# EAGLE design LM3914 (EAGLE 6.6.0)
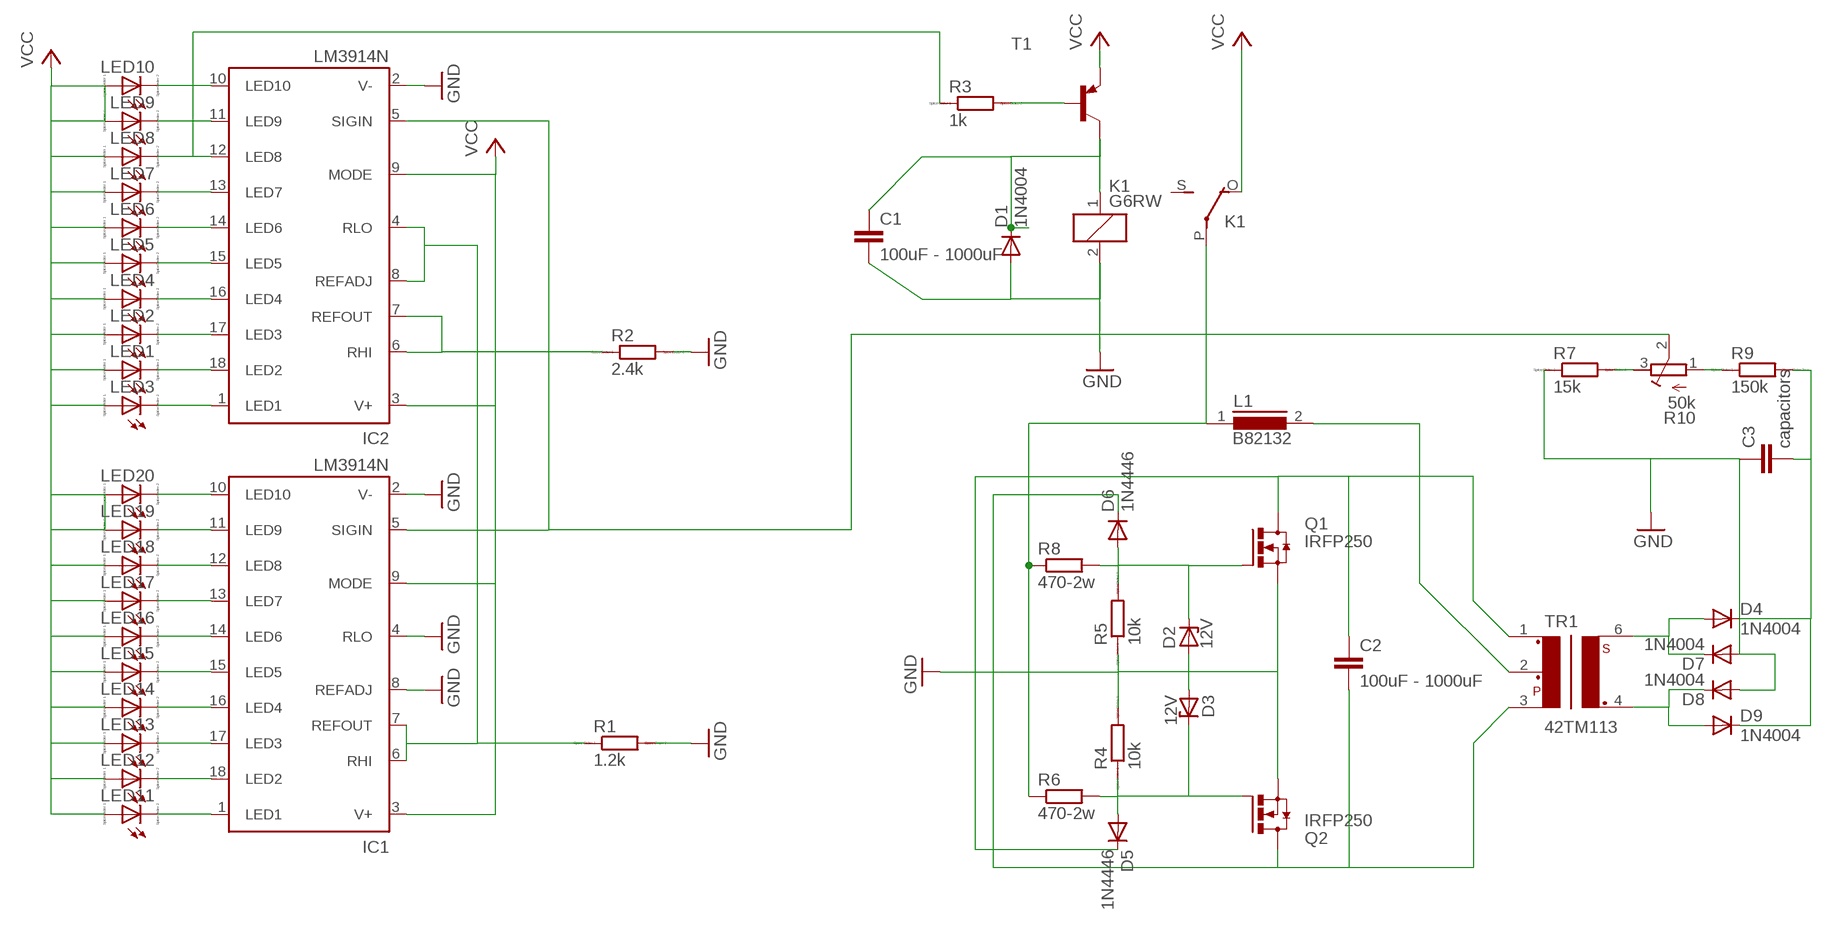
[diagram p0: schematic, sheet 1]

## Parts
C1  100uF - 1000uF  C2,5-3  [C2.5-3]
C2  100uF - 1000uF  C2,5-3  [C2.5-3]
C3  capacitors  C37/20  [C37.5B20]
D1  1N4004  [DO41-10]
D2  12V  ZENER-DIODEC1702-15  [C1702-15]
D3  12V  ZENER-DIODEC1702-15  [C1702-15]
D4  1N4004  [DO41-10]
D5  1N4446  [DO35-10]
D6  1N4446  [DO35-10]
D7  1N4004  [DO41-10]
D8  1N4004  [DO41-10]
D9  1N4004  [DO41-10]
IC1  LM3914N  [DIL18]
IC2  LM3914N  [DIL18]
K1  G6RW  [G6RW]
L1  B82132  [SUKW2-22]
LED1  LED_ELD260  [LED_LD260]
LED2  LED_ELD260  [LED_LD260]
LED3  LED_ELD260  [LED_LD260]
LED4  LED_ELD260  [LED_LD260]
LED5  LED_ELD260  [LED_LD260]
LED6  LED_ELD260  [LED_LD260]
LED7  LED_ELD260  [LED_LD260]
LED8  LED_ELD260  [LED_LD260]
LED9  LED_ELD260  [LED_LD260]
LED10  LED_ELD260  [LED_LD260]
LED11  LED_ELD260  [LED_LD260]
LED12  LED_ELD260  [LED_LD260]
LED13  LED_ELD260  [LED_LD260]
LED14  LED_ELD260  [LED_LD260]
LED15  LED_ELD260  [LED_LD260]
LED16  LED_ELD260  [LED_LD260]
LED17  LED_ELD260  [LED_LD260]
LED18  LED_ELD260  [LED_LD260]
LED19  LED_ELD260  [LED_LD260]
LED20  LED_ELD260  [LED_LD260]
Q1  IRFP250  [TO-247AD-V]
Q2  IRFP250  [TO-247AD-V]
R1  1.2k  R0207/10  [0207/10]
R2  2.4k  R0207/10  [0207/10]
R3  1k  R0207/10  [0207/10]
R4  10k  R0207/10  [0207/10]
R5  10k  R0207/10  [0207/10]
R6  470-2w  R-EU_RDH/15  [RDH/15]
R7  15k  R0207/10  [0207/10]
R8  470-2w  R-EU_RDH/15  [RDH/15]
R9  150k  R0207/10  [0207/10]
R10  50k  R-TRIMM64X  [RTRIM64X]
T1  -PNP-TO220V  [TO220V]
TR1  42TM113  [42TM]

## Nets
GND: C1.2 C3.1 D1.A D2.A D3.A D7.A D8.A IC1.2(V-) IC1.4(RLO) IC1.8(REFADJ) IC2.2(V-) K1.2 Q1.S Q2.S R1.2 R2.2 R4.2 R5.1 R7.1
N$1: IC2.1(LED1) LED3.K(C)
N$2: IC2.18(LED2) LED1.K(C)
N$3: IC2.17(LED3) LED2.K(C)
N$4: IC2.16(LED4) LED4.K(C)
N$5: IC2.15(LED5) LED5.K(C)
N$6: IC2.14(LED6) LED6.K(C)
N$7: C2.1 D5.C Q1.D TR1.1
N$8: IC2.12(LED8) LED8.K(C) R3.1
N$9: IC2.11(LED9) LED9.K(C)
N$10: IC2.10(LED10) LED10.K(C)
N$11: IC1.5(SIGIN) IC2.5(SIGIN) R10.2(S)
N$12: IC1.1(LED1) LED11.K(C)
N$13: IC1.18(LED2) LED12.K(C)
N$14: IC1.17(LED3) LED13.K(C)
N$15: IC1.16(LED4) LED14.K(C)
N$16: IC1.15(LED5) LED15.K(C)
N$17: IC1.14(LED6) LED16.K(C)
N$18: IC1.13(LED7) LED17.K(C)
N$19: IC1.12(LED8) LED18.K(C)
N$20: IC1.11(LED9) LED19.K(C)
N$21: IC1.10(LED10) LED20.K(C)
N$22: IC1.6(RHI) IC1.7(REFOUT) IC2.4(RLO) IC2.8(REFADJ) R1.1
N$23: C1.1 D1.C K1.1 T1.2(C)
N$24: IC2.6(RHI) IC2.7(REFOUT) R2.1
N$25: R3.2 T1.1(B)
N$26: C2.2 D6.C Q2.D TR1.3
N$27: IC2.13(LED7) LED7.K(C)
N$28: D3.C D5.A Q2.G R4.1 R6.2
N$30: D2.C D6.A Q1.G R5.2 R8.2
N$31: K1.P(2:P) L1.1 R6.1 R8.1
N$32: L1.2 TR1.2
N$34: D4.A D7.C TR1.6
N$35: D8.C D9.A TR1.4
N$37: C3.2 D4.C D9.C R9.2
N$38: R9.1 R10.1(A)
N$39: R7.2 R10.3(E)
VCC: IC1.3(V+) IC1.9(MODE) IC2.3(V+) IC2.9(MODE) K1.O(2:O) LED1.A LED2.A LED3.A LED4.A LED5.A LED6.A LED7.A LED8.A LED9.A LED10.A LED11.A LED12.A LED13.A LED14.A LED15.A LED16.A LED17.A LED18.A LED19.A LED20.A T1.3(E)
Unconnected: K1.S(2:S)

## Library data of the parts
C1-C3 = capacitor-wima:C: CAPACITOR naming: grid - package width
D1 D4 D7-D9 = diode:1N4004: DIODE general purpose rectifier, 1 A
D2 D3 = diode:ZENER-DIODE: Z-Diode
D5 D6 = diode:1N4446: DIODE high speed (Philips)
IC1 IC2 = national-semiconductor:LM391: Dot/Bar Display Driver Source: Data sheet LM3915 <http://www.national.com/ds/LM/LM3915.pdf> Data sheet LM3914 <http://www.national.com/ds/LM/LM3914.pdf>
K1 = relay:G6RW: RELAY 1 x switch, Omron; OC_FARNELL: unknown; OC_NEWARK: unknown
L1 = inductors:B82132: INDUCTOR
LED1-LED20 = eagle-ltspice:LED_E: LED Source: http://www.osram.convergy.de Source: www.luxeon.com Source: www.kingbright.com; SPICEMODEL: NONE; SPICEPREFIX: D; SPICETYPE: diode
Q1 Q2 = transistor-power:IRFP25*: 33A/27A, 200V/150V, 0.085/0.012 Ohm, N-Channel Power MOSFET Source: Fairchild Semiconductor Corporation
R1-R5 R7 R9 = eagle-ltspice:R: RESISTOR, European symbol; SPICEMODEL: NONE; SPICEPREFIX: R
R6 R8 = rcl:R-EU_: RESISTOR, European symbol
R10 = rcl:R-TRIMM: Trimm resistor
T1 = transistor:*-PNP-: PNP Transistror
TR1 = trafo-xicon:42TM113: Transformer Mouser 42TLM Series Source: http://www.mouser.com/catalog/specsheets/164267.pdf; OC_FARNELL: unknown; OC_NEWARK: unknown

## Board
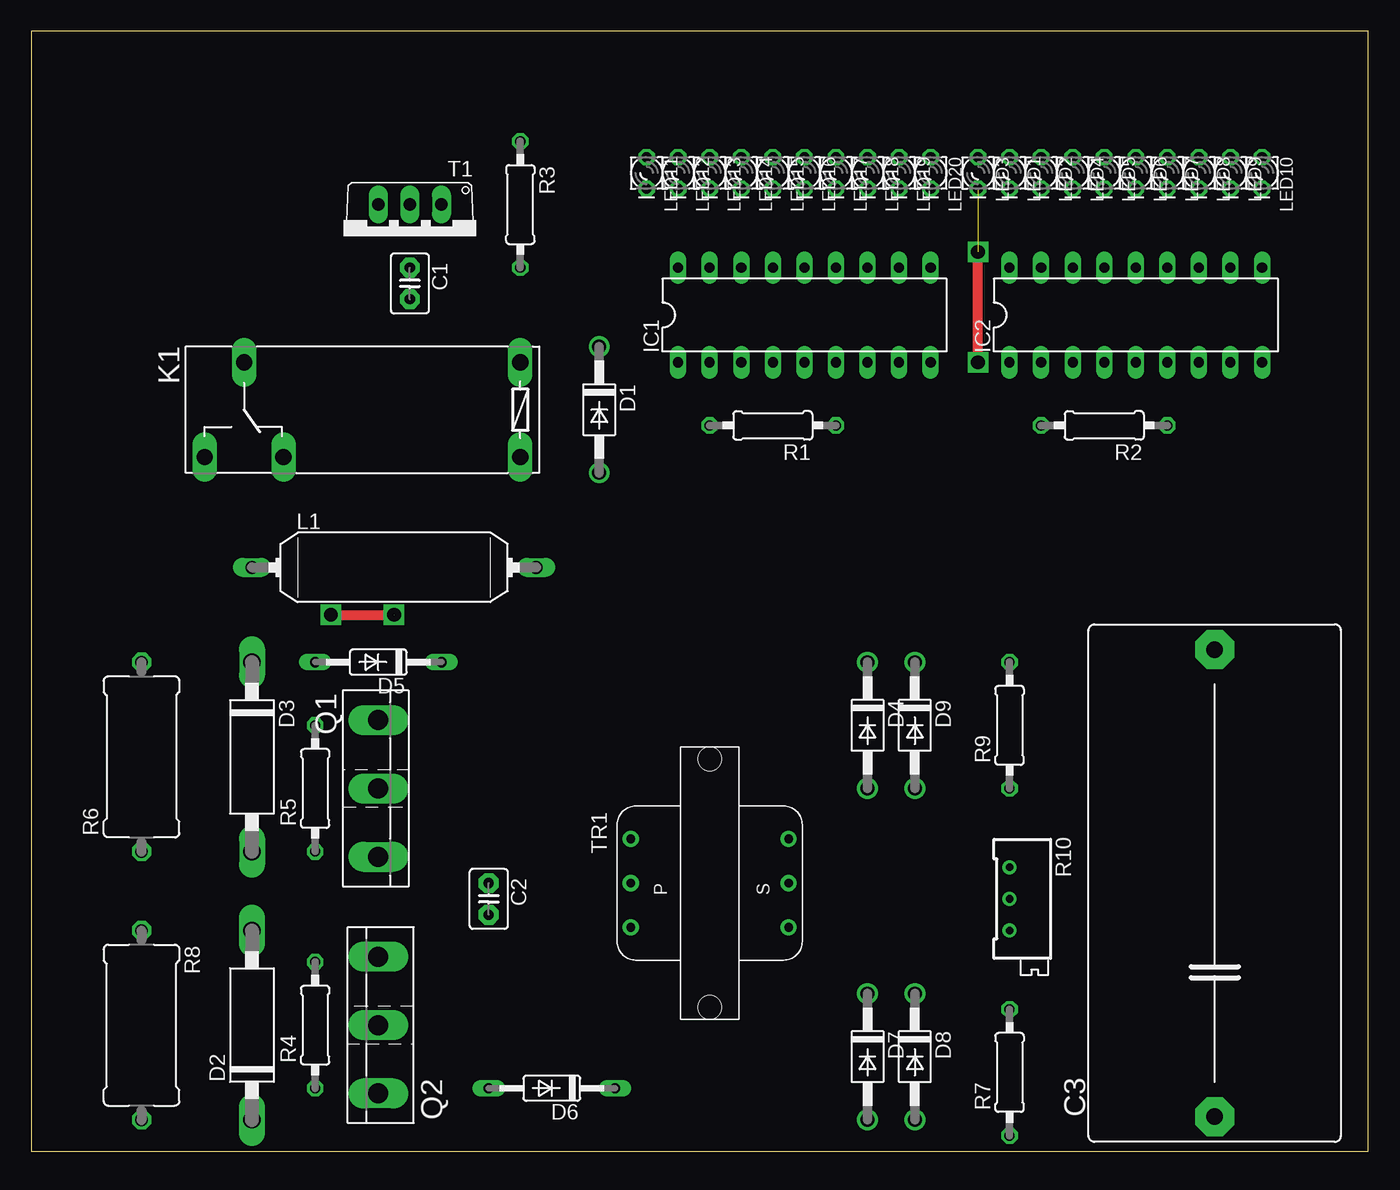
[diagram p1: board, top side]
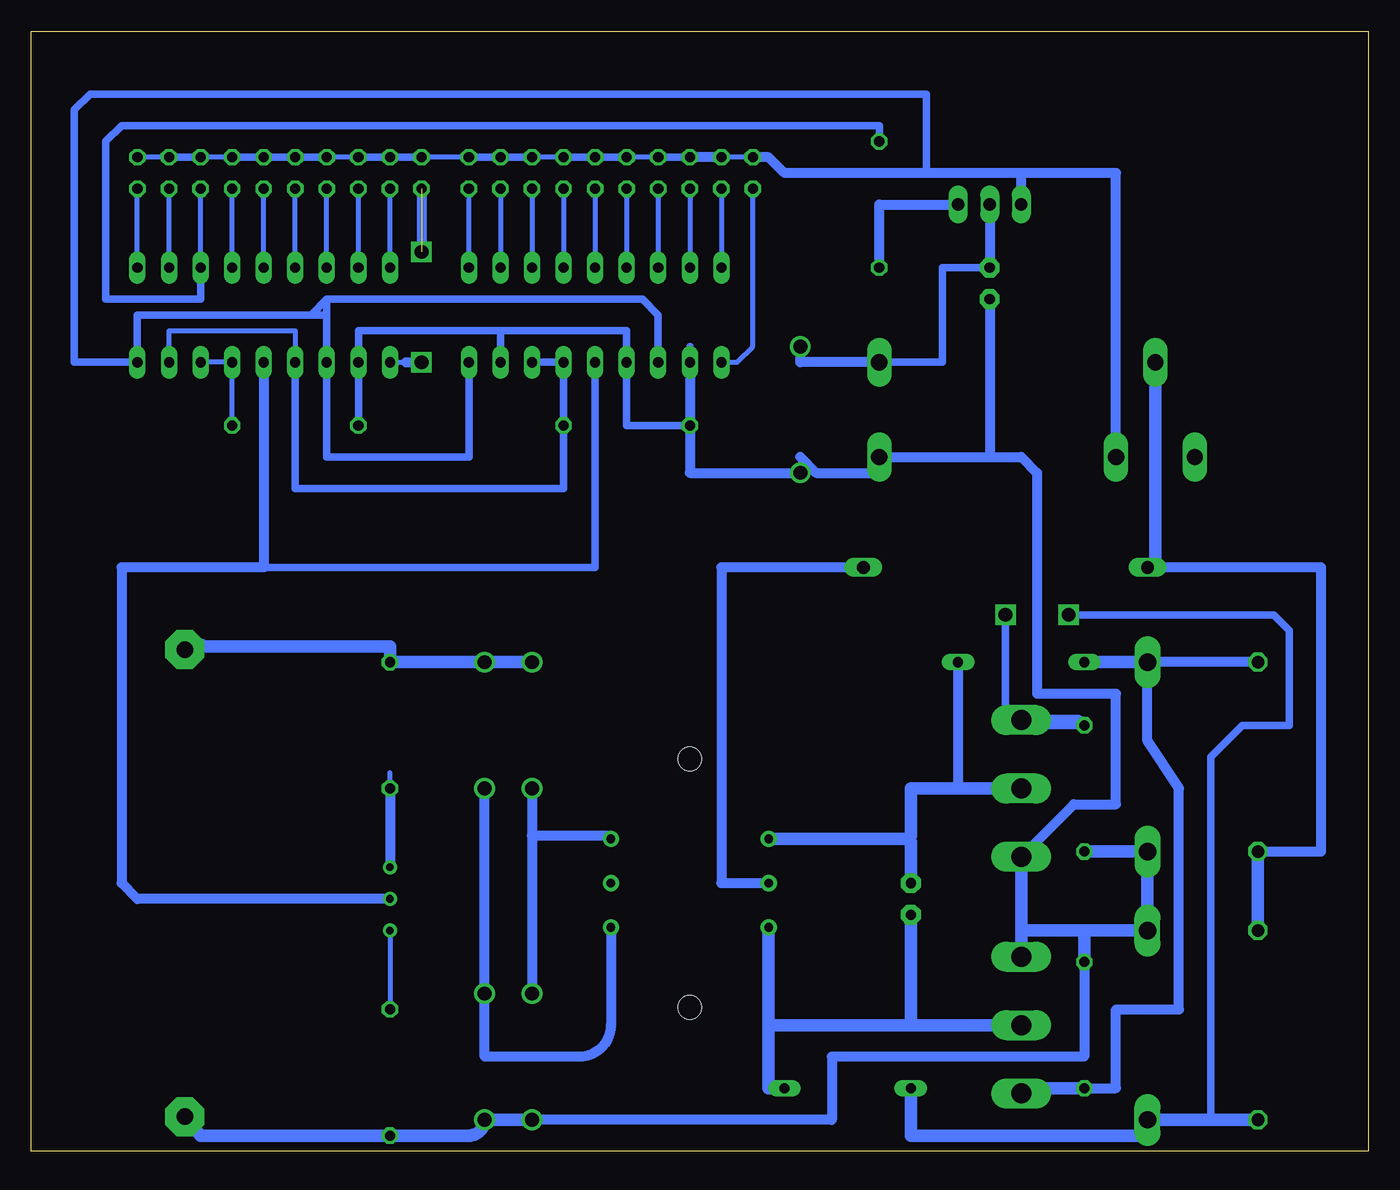
[diagram p2: board, bottom side, seen from below]

Size 107.62 x 90.16 mm. Coordinates in mm from the lower left corner, seen from the top.
Outline: 0,0 107.62,0 107.62,90.16 0,90.16 0,0
Copper layers (1*16): Top 0.035mm / dielectric 1.5mm / Bottom 0.035mm
Design rules "default": minimum track width 10mil, minimum drill 24mil, track to track 8mil, track to pad 8mil, pad to pad 8mil, via to via 8mil, smd to smd 8mil, copper to edge 40mil, drill to drill 8mil, minimum pad ring 10mil, minimum via ring 8mil, stop-mask expansion 4mil, vias tented up to drill 0mil, thermal gap 10mil

### Footprints (pad centres in the part's own frame; a part is rotated, then mirrored left to right if it is on the bottom)
C2.5-3 = drill 0.813 pad 1.6 octagon: 1 -1.27,0; 2 1.27,0
C37.5B20 = drill 1.321 pad 3.15 octagon: 1 -18.796,0; 2 18.796,0
DO41-10 = drill 1.118: A 5.08,0; C -5.08,0
C1702-15 = drill 1.397 long: A 7.62,0; C -7.62,0
DO35-10 = drill 0.813 long: A 5.08,0; C -5.08,0
DIL18 = drill 0.813 long: 1 -10.16,-3.81; 2 -7.62,-3.81; 3 -5.08,-3.81; 4 -2.54,-3.81; 5 0,-3.81; 6 2.54,-3.81; 7 5.08,-3.81; 8 7.62,-3.81; 9 10.16,-3.81; 10 10.16,3.81; 11 7.62,3.81; 12 5.08,3.81; 13 2.54,3.81; 14 0,3.81; 15 -2.54,3.81; 16 -5.08,3.81; 17 -7.62,3.81; 18 -10.16,3.81
G6RW = drill 1.321 long: 1 -12.7,-3.81; 2 -12.7,3.81; O 6.35,3.81; P 9.525,-3.81; S 12.7,3.81
SUKW2-22 = drill 1.016 long: 1 -11.43,0; 2 11.43,0
LED_LD260 = drill 0.813 octagon: A -1.27,0; K 1.27,0
TO-247AD-V = drill 1.6 long: D 0,-2.54; G -5.5,-2.54; S 5.5,-2.54
0207/10 = drill 0.813 octagon: 1 -5.08,0; 2 5.08,0
RDH/15 = drill 1.016 octagon: 1 -7.62,0; 2 7.62,0
RTRIM64X = drill 0.61: 1 1.27,-2.54; 2 1.27,0; 3 1.27,2.54
TO220V = drill 1.016 long: 1 -2.54,-2.54; 2 0,-2.54; 3 2.54,-2.54
42TM = drill 0.7 pad 1.3: 1 -3.556,-6.35; 2 0,-6.35; 3 3.556,-6.35; 4 3.556,6.35; 5 0,6.35; 6 -3.556,6.35 | hole 1.9: -9.982,0; 9.982,0

### Placement (x,y rotation side)
C1  30.48,69.85 270 top
C2  36.83,20.32 270 top
C3  95.25,21.59 90 top
D1  45.72,59.69 270 top
D2  17.78,10.16 90 top
D3  17.78,31.75 270 top
D4  67.31,34.29 270 top
D5  27.94,39.37 180 top
D6  41.91,5.08 180 top
D7  67.31,7.62 270 top
D8  71.12,7.62 270 top
D9  71.12,34.29 270 top
IC1  62.23,67.31 0 top
IC2  88.9,67.31 0 top
K1  26.67,59.69 180 top
L1  29.21,46.99 0 top
LED1  78.74,78.74 270 top
LED2  81.28,78.74 270 top
LED3  76.2,78.74 270 top
LED4  83.82,78.74 270 top
LED5  86.36,78.74 270 top
LED6  88.9,78.74 270 top
LED7  91.44,78.74 270 top
LED8  93.98,78.74 270 top
LED9  96.52,78.74 270 top
LED10  99.06,78.74 270 top
LED11  49.53,78.74 270 top
LED12  52.07,78.74 270 top
LED13  54.61,78.74 270 top
LED14  57.15,78.74 270 top
LED15  59.69,78.74 270 top
LED16  62.23,78.74 270 top
LED17  64.77,78.74 270 top
LED18  67.31,78.74 270 top
LED19  69.85,78.74 270 top
LED20  72.39,78.74 270 top
Q1  30.48,29.21 270 top
Q2  25.4,10.16 90 top
R1  59.69,58.42 180 top
R2  86.36,58.42 180 top
R3  39.37,76.2 270 top
R4  22.86,10.16 90 top
R5  22.86,29.21 90 top
R6  8.89,31.75 90 top
R7  78.74,6.35 90 top
R8  8.89,10.16 270 top
R9  78.74,34.29 90 top
R10  80.01,20.32 180 top
T1  30.48,73.66 180 top
TR1  54.61,21.59 270 top

### Tracks (layer width: path | path; a pad name or v marks a point on that pad's centre or on a via)
GND
  Bottom 0.406: D8.A arc90 72.39,1.27 | 45.72,55.88 D1.A
  Bottom 0.61: IC1.2 54.61,64.77 | 69.85,66.04 59.69,66.04 IC1.4 59.69,58.42 R1.2 | 69.85,66.04 81.28,66.04 IC2.2 R2.2 | IC1.8 69.85,66.04
  Bottom 0.813: D8.A arc90 72.39,1.27 | D7.A 43.18,2.54 43.18,7.62 22.86,7.62 22.86,17.78 | Q1.S 23.71,27.94 20.32,27.94 20.32,36.83 26.67,36.83 26.67,54.61 27.94,55.88 30.48,55.88 | IC1.2 R1.2 54.61,54.61 D1.A | 45.72,55.88 44.45,54.61 39.37,54.61 K1.2 30.48,55.88 | C1.2 30.48,55.88
  Bottom 1.016: D7.A D8.A arc90 72.39,1.27 R7.1 93.98,1.27 C3.1 | R5.1 D3.A D2.A 22.86,17.78 | 22.86,17.78 27.94,17.78 Q2.S Q1.S | R4.2 22.86,17.78
N$1  (2 unrouted)
  Top 0.813: 76.2,63.5 76.2,72.39
  Bottom 0.406: IC2.1 77.47,63.5
  Bottom 0.813: 77.47,63.5 76.2,63.5 | LED3.K 76.2,72.39
N$2
  Bottom 0.406: IC2.18 LED1.K
N$3
  Bottom 0.406: IC2.17 LED2.K
N$4
  Bottom 0.406: IC2.16 LED4.K
N$5  (1 unrouted)
  Bottom 0.406: IC2.15 LED5.K
N$6
  Bottom 0.406: IC2.14 LED6.K
N$7
  Bottom 0.813: D5.C 33.02,29.21 Q1.D
  Bottom 1.016: 37.08,25.15 36.83,25.4 36.83,29.21 Q1.D | 37.08,25.15 TR1.1 | 37.08,25.15 36.83,24.89 C2.1
N$8
  Bottom 0.406: IC2.12 LED8.K
  Bottom 0.61: IC2.12 93.98,68.58 101.6,68.58 101.6,81.28 100.33,82.55 39.37,82.55 R3.1
N$9
  Bottom 0.406: IC2.11 LED9.K
N$10
  Bottom 0.406: IC2.10 LED10.K
N$11
  Bottom 0.61: IC1.5 62.23,46.99 90.17,46.99
  Bottom 0.813: R10.2 99.06,20.32 100.33,21.59 100.33,46.99 90.17,46.99 88.9,46.99 IC2.5
N$12
  Bottom 0.406: IC1.1 50.8,63.5 49.53,64.77 LED11.K
N$13
  Bottom 0.406: LED12.K IC1.18
N$14
  Bottom 0.406: LED13.K IC1.17
N$15
  Bottom 0.406: LED14.K IC1.16
N$16
  Bottom 0.406: LED15.K IC1.15
N$17
  Bottom 0.406: LED16.K IC1.14
N$18
  Bottom 0.406: LED17.K IC1.13
N$19
  Bottom 0.406: LED18.K IC1.12
N$20
  Bottom 0.406: LED19.K IC1.11
N$21
  Bottom 0.406: IC1.10 LED20.K
N$22
  Bottom 0.406: IC2.8 96.52,66.04 86.36,66.04 IC2.4
  Bottom 0.61: IC1.7 IC1.6 R1.1 64.77,53.34 86.36,53.34 IC2.4
N$23
  Bottom 0.61: K1.1 34.29,63.5 34.29,71.12 C1.1
  Bottom 0.813: T1.2 C1.1 | K1.1 45.72,63.5 D1.C
N$24
  Bottom 0.406: IC2.7 IC2.6 R2.1
N$25
  Bottom 0.813: R3.2 39.37,76.2 T1.1
N$26
  Bottom 1.016: D6.C 48.26,5.08 48.26,10.16 | 48.26,10.16 TR1.3 | Q2.D 36.83,10.16 | 36.83,10.16 48.26,10.16 | C2.2 36.83,10.16
N$27
  Bottom 0.406: IC2.13 LED7.K
N$28
  Bottom 0.813: R4.1 20.32,5.08 20.32,11.43 15.24,11.43 15.24,29.21 17.78,33.02 D3.C | R6.2 19.05,39.37
  Bottom 1.016: R4.1 27.94,5.08 Q2.G | D3.C 19.05,39.37 D5.A
N$29  (via drill 1.1)
  other vias: 29.21,43.18
N$30  (via drill 1.1)  (1 unrouted)
  Top 0.813: v24.13,43.18 29.21,43.18
  Bottom 0.61: 12.7,2.54 12.7,31.75 10.16,34.29 6.35,34.29 6.35,41.91 7.62,43.18 v24.13,43.18 | 24.13,34.71 23.71,34.29 R5.2 27.94,34.29 29.21,35.56 29.21,43.18
  Bottom 0.813: R5.2 23.28,34.71 24.13,34.71 Q1.G
  Bottom 1.016: R8.2 12.7,2.54 D2.C 17.78,1.27 36.83,1.27 D6.A
  other vias: 76.2,63.5 76.2,72.39
N$31
  Bottom 0.813: R6.1 3.81,24.13 3.81,46.99 L1.1
  Bottom 1.016: R8.1 R6.1 | L1.1 17.14,47.62 K1.P
N$32
  Bottom 0.813: L1.2 52.07,46.99 52.07,21.59 TR1.2
N$34
  Bottom 0.813: D4.A 67.31,25.4 | 67.31,25.4 D7.C | TR1.6 arc-90 61.21,25.4 67.31,25.4
N$35
  Bottom 0.813: D9.A D8.C 71.12,7.62 63.5,7.62 arc-90 60.96,10.16 TR1.4
N$37
  Bottom 1.016: C3.2 arc90 93.73,40.64 78.74,40.64 R9.2 D4.C D9.C
N$38
  Bottom 0.406: R9.1 78.74,30.48
  Bottom 0.813: R9.1 R10.1
N$39
  Bottom 0.406: R10.3 R7.2
VCC
  Bottom 0.406: LED11.A LED12.A | LED14.A LED15.A | LED17.A LED18.A | LED20.A LED3.A | LED2.A LED4.A | LED7.A LED8.A | LED9.A LED10.A | 99.06,64.77 IC2.9
  Bottom 0.61: 85.09,67.31 83.82,67.31 | 83.82,67.31 IC2.3 83.82,55.88 72.39,55.88 IC1.9 | IC1.3 57.15,67.31 58.42,68.58 83.82,68.58 | 83.82,68.58 83.82,67.31 | LED13.A LED14.A | LED15.A LED16.A LED17.A | LED18.A LED19.A LED20.A | LED3.A LED1.A LED2.A | LED4.A LED5.A LED6.A LED7.A | LED9.A LED8.A | 83.82,68.58 85.09,67.31 | 85.09,67.31 99.06,67.31 IC2.9 104.14,63.5 104.14,83.82 102.87,85.09 35.56,85.09 35.56,78.74
  Bottom 0.813: LED12.A LED13.A | K1.O 20.32,78.74 27.94,78.74 | 27.94,78.74 35.56,78.74 46.99,78.74 48.26,80.01 LED11.A | T1.3 27.94,78.74